# EAGLE schematic usb-audio01 (EAGLE 6.2)
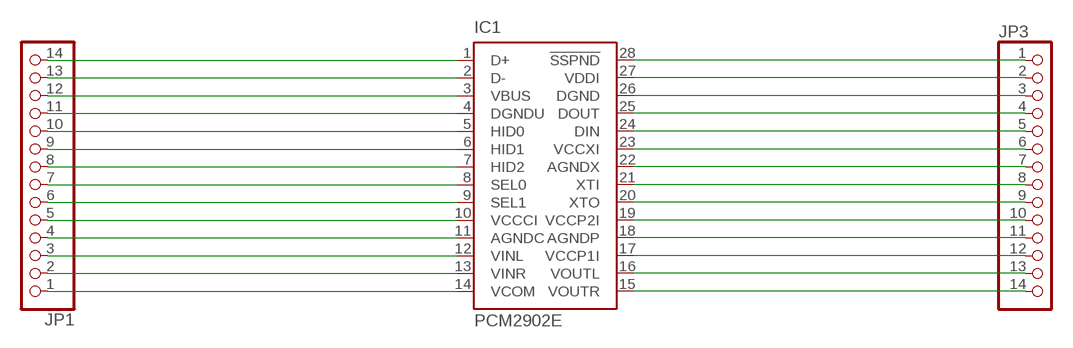
[diagram p0: schematic, sheet 1]

## Parts
IC1  PCM2902E  [SSOP28DB]
JP1  PINHD-1X14  [1X14]
JP3  PINHD-1X14  [1X14]

## Nets
N$1: IC1.28(!SSPND) JP3.1
N$2: IC1.27(VDDI) JP3.2
N$3: IC1.26(DGND) JP3.3
N$4: IC1.25(DOUT) JP3.4
N$5: IC1.24(DIN) JP3.5
N$6: IC1.23(VCCXI) JP3.6
N$7: IC1.22(AGNDX) JP3.7
N$8: IC1.21(XTI) JP3.8
N$9: IC1.20(XTO) JP3.9
N$10: IC1.19(VCCP2I) JP3.10
N$11: IC1.18(AGNDP) JP3.11
N$12: IC1.17(VCCP1I) JP3.12
N$13: IC1.16(VOUTL) JP3.13
N$14: IC1.15(VOUTR) JP3.14
N$15: IC1.14(VCOM) JP1.1
N$16: IC1.13(VINR) JP1.2
N$17: IC1.12(VINL) JP1.3
N$18: IC1.11(AGNDC) JP1.4
N$19: IC1.10(VCCCI) JP1.5
N$20: IC1.9(SEL1) JP1.6
N$21: IC1.8(SEL0) JP1.7
N$22: IC1.7(HID2) JP1.8
N$23: IC1.6(HID1) JP1.9
N$24: IC1.5(HID0) JP1.10
N$25: IC1.4(DGNDU) JP1.11
N$26: IC1.3(VBUS) JP1.12
N$27: IC1.2(D-) JP1.13
N$28: IC1.1(D+) JP1.14

## Library data of the parts
IC1 = texas:PCM290*: STEREO AUDIO CODEC WITH USB INTERFACE SINGLE-ENDED ANALOG INPUT/OUTPUT AND S/PDIF; MF: TEXAS INSTRUMENT CONNECTORS; MPN: PCM2902E; OC_FARNELL: 1207089; OC_NEWARK: 75C5380
JP1 JP3 = pinhead:PINHD-1X14: PIN HEADER